# Altium schematic sheet Rasp.SchDoc
size A4
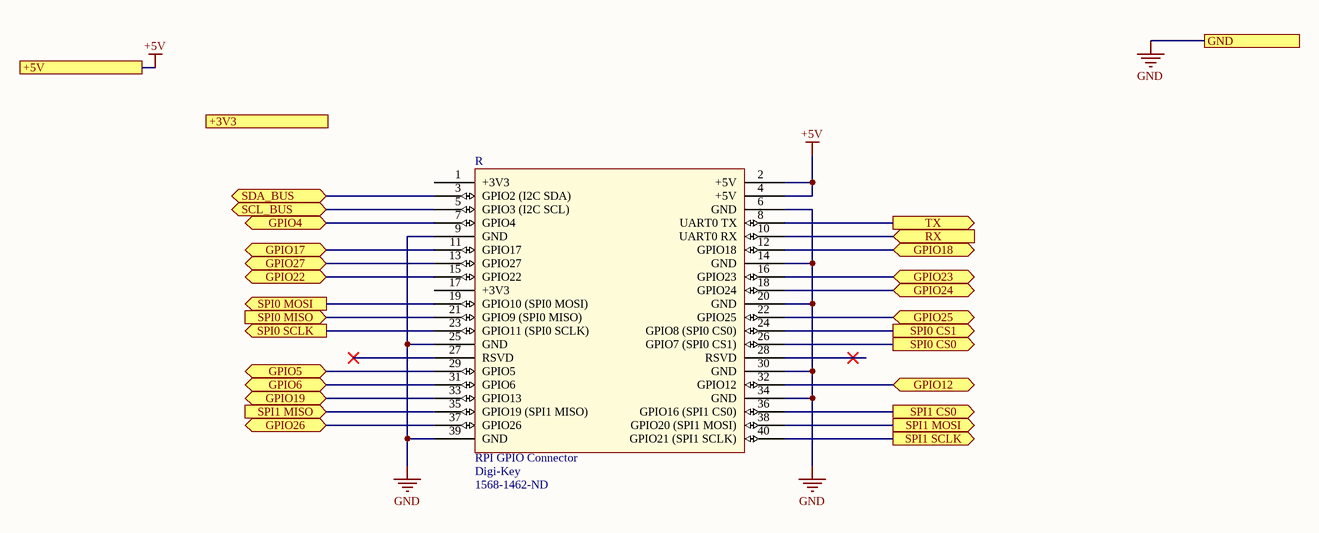
[diagram p0: Rasp.SchDoc]

## Parts
R  RPI GPIO Connector  Supplier 1: Digi-Key  Supplier Part Number 1: 1568-1462-ND  [rpi]

## Ports
+3V3, +5V, GND, GPIO4 (bidir), GPIO5 (bidir), GPIO6 (bidir), GPIO12 (bidir), GPIO17 (bidir), GPIO18 (bidir), GPIO19 (bidir), GPIO22 (bidir), GPIO23 (bidir), GPIO24 (bidir), GPIO25 (bidir), GPIO26 (bidir), GPIO27 (bidir), RX (in), SCL_BUS (bidir), SDA_BUS (bidir), SPI0 CS0 (out), SPI0 CS1 (out), SPI0 MISO (in), SPI0 MOSI (out), SPI0 SCLK (out), SPI1 CS0 (out), SPI1 MISO (in), SPI1 MOSI (out), SPI1 SCLK (out), TX (out)

## Nets
+5V: R.2(+5V) R.4(+5V) ; port +5V
GND: R.6(GND) R.9(GND) R.14(GND) R.20(GND) R.25(GND) R.30(GND) R.34(GND) R.39(GND) ; port GND
GPIO4: R.7(GPIO4) ; port GPIO4
GPIO5: R.29(GPIO5) ; port GPIO5
GPIO6: R.31(GPIO6) ; port GPIO6
GPIO12: R.32(GPIO12) ; port GPIO12
GPIO17: R.11(GPIO17) ; port GPIO17
GPIO18: R.12(GPIO18) ; port GPIO18
GPIO19: R.33(GPIO13) ; port GPIO19
GPIO22: R.15(GPIO22) ; port GPIO22
GPIO23: R.16(GPIO23) ; port GPIO23
GPIO24: R.18(GPIO24) ; port GPIO24
GPIO25: R.22(GPIO25) ; port GPIO25
GPIO26: R.37(GPIO26) ; port GPIO26
GPIO27: R.13(GPIO27) ; port GPIO27
RX: R.10(UART0_RX) ; port RX
SCL_BUS: R.5(GPIO3_(I2C_SCL)) ; port SCL_BUS
SDA_BUS: R.3(GPIO2_(I2C_SDA)) ; port SDA_BUS
SPI0 CS0: R.26(GPIO7_(SPI0_CS1)) ; port SPI0 CS0
SPI0 CS1: R.24(GPIO8_(SPI0_CS0)) ; port SPI0 CS1
SPI0 MISO: R.21(GPIO9_(SPI0_MISO)) ; port SPI0 MISO
SPI0 MOSI: R.19(GPIO10_(SPI0_MOSI)) ; port SPI0 MOSI
SPI0 SCLK: R.23(GPIO11_(SPI0_SCLK)) ; port SPI0 SCLK
SPI1 CS0: R.36(GPIO16_(SPI1_CS0)) ; port SPI1 CS0
SPI1 MISO: R.35(GPIO19_(SPI1_MISO)) ; port SPI1 MISO
SPI1 MOSI: R.38(GPIO20_(SPI1_MOSI)) ; port SPI1 MOSI
SPI1 SCLK: R.40(GPIO21_(SPI1_SCLK)) ; port SPI1 SCLK
TX: R.8(UART0_TX) ; port TX

Not connected (* = marked no-connect by the designer): R 1(+3V3) 17(+3V3) 27(RSVD)* 28(RSVD)*

## Library data of the parts
R = rpi connector: GPIO Header for Raspberry Pi A+/B+/Pi 2/Pi 3 - 2x20; Manufacturer: SparkFun Electronics; Manufacturer Part Number: PRT-14017; Nils Minor: author; nilsminor@web.de: mail; RoHS: RoHS Compliant; Category: Development Boards, Kits, Programmers; Stock 1: 150; Pricing 1: 1=1.84 (EUR); Part Status: Active; Accessory Type: Connector; For Use With/Related Products: Raspberry Pi; ComponentLink1URL: https://cdn.sparkfun.com/datasheets/Dev/RaspberryPi/12313.pdf; ComponentLink1Description: https://cdn.sparkfun.com/datasheets/Dev/RaspberryPi/12313.pdf